# Altium schematic sheet SENSORS.SchDoc
size A3; SheetNumber: 5; SheetTotal: 9
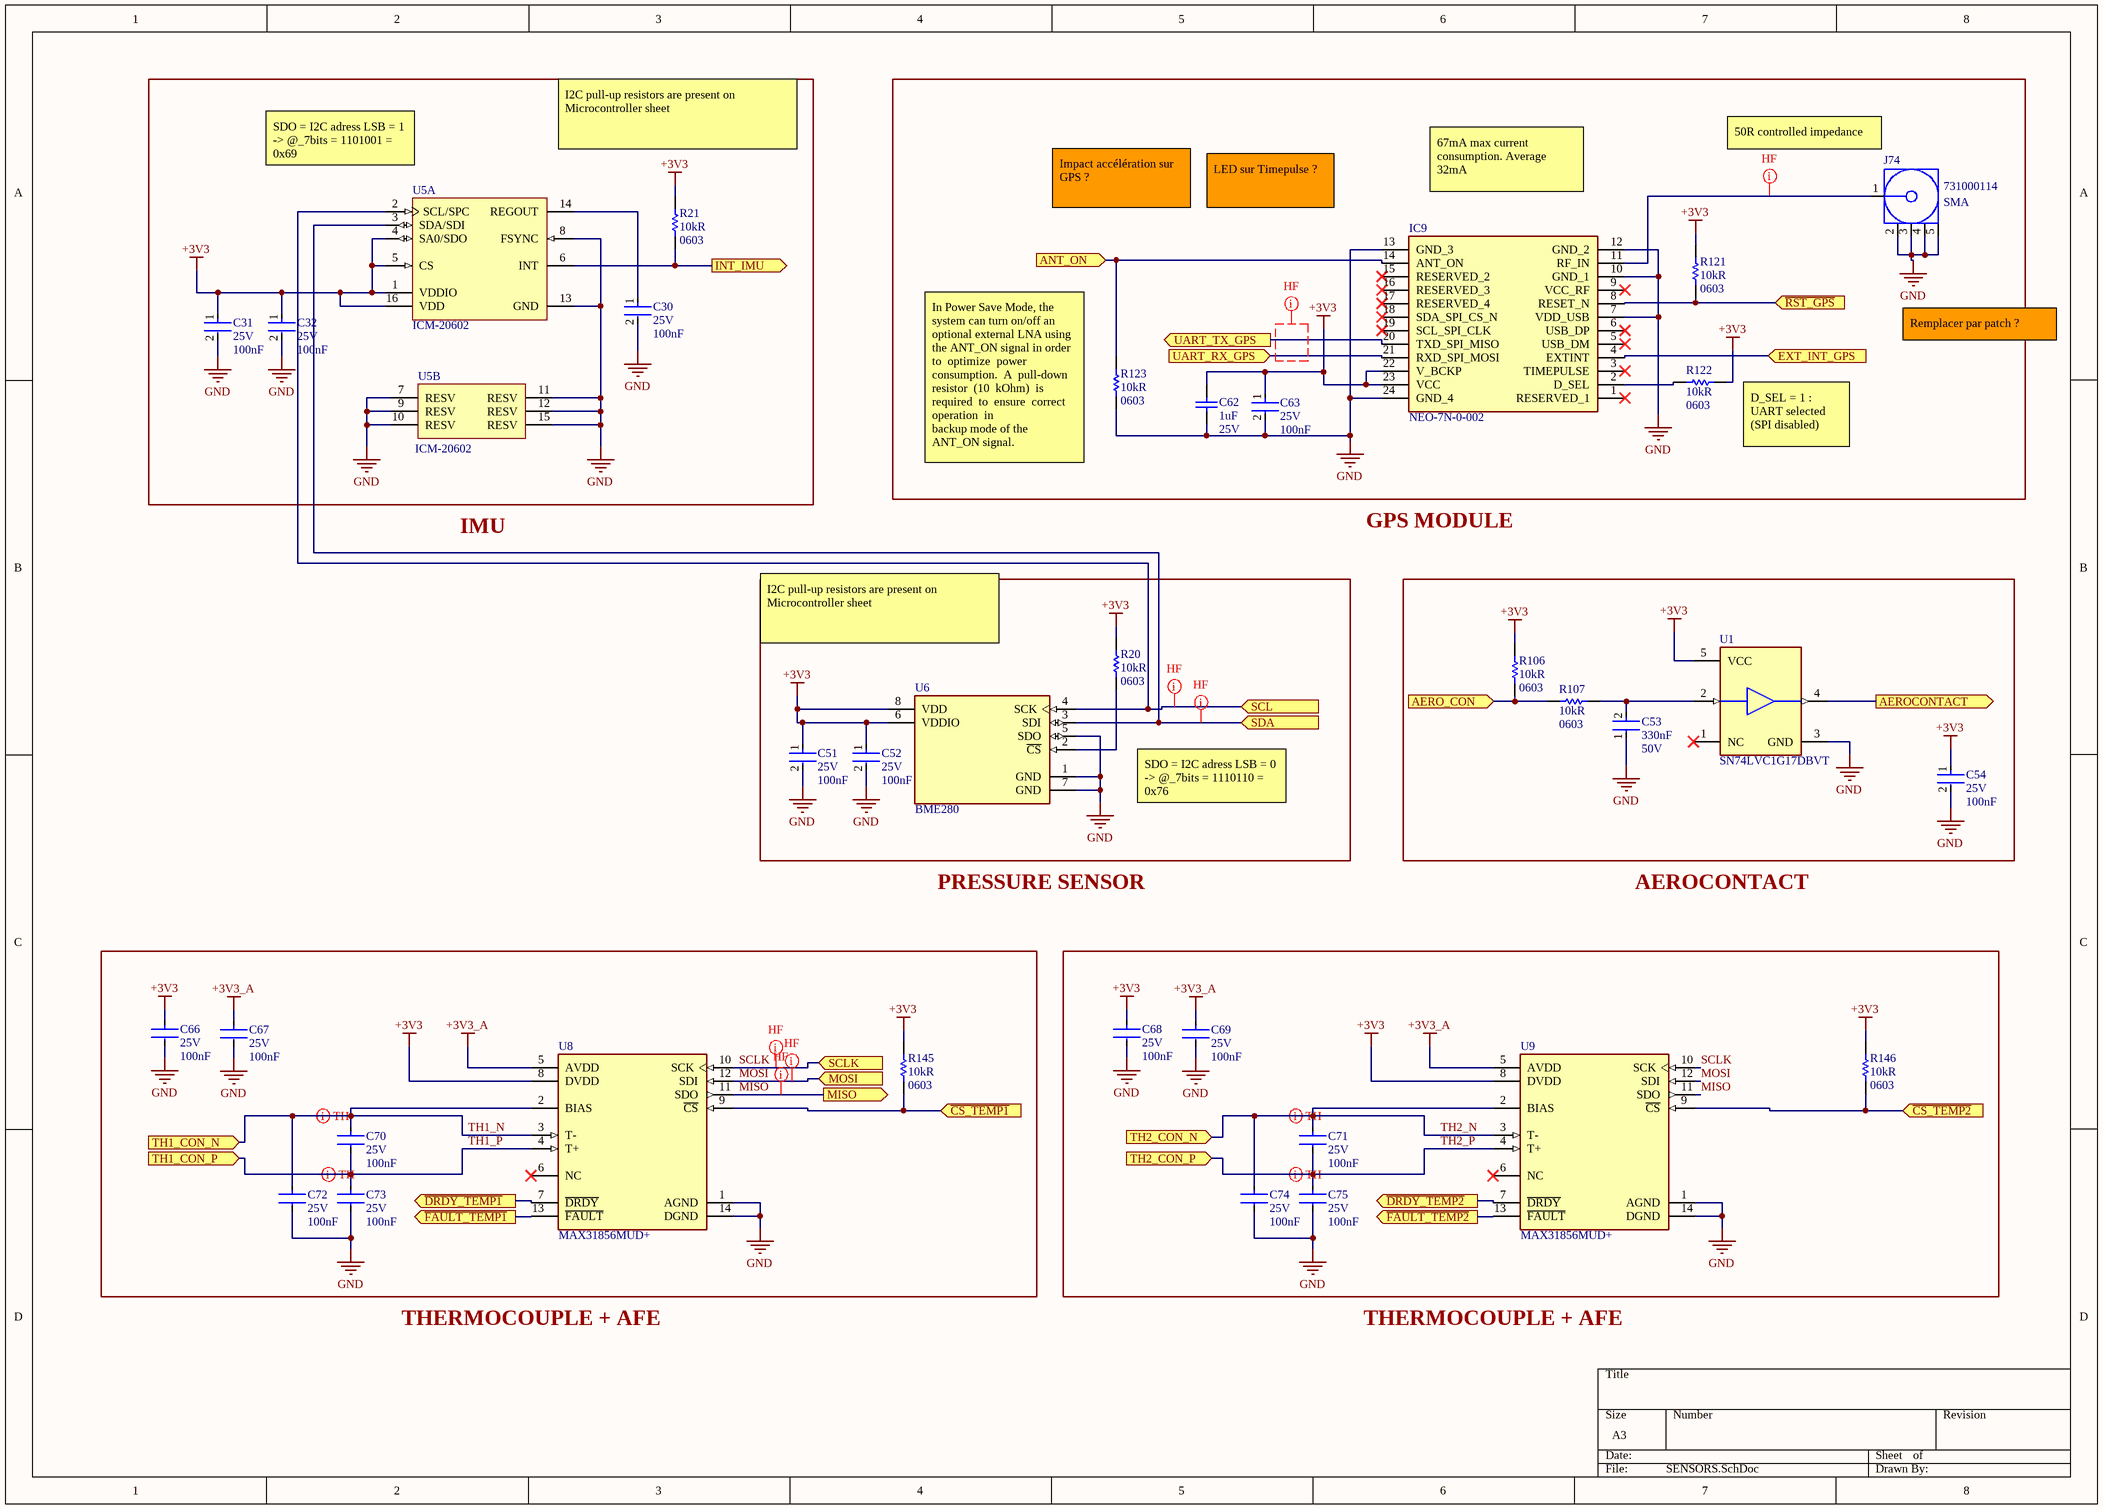
[diagram p0: SENSORS.SchDoc]

## Parts
C30  Voltage Rating (DC): 25V  Capacitance: 100nF  [FP-CGA3E-0_3-0_1-MFG]  (hidden comment: CGA3E2X7R1E104K080AA)
C31  Voltage Rating (DC): 25V  Capacitance: 100nF  [FP-CGA3E-0_3-0_1-MFG]  (hidden comment: CGA3E2X7R1E104K080AA)
C32  Voltage Rating (DC): 25V  Capacitance: 100nF  [FP-CGA3E-0_3-0_1-MFG]  (hidden comment: CGA3E2X7R1E104K080AA)
C51  Voltage Rating (DC): 25V  Capacitance: 100nF  [FP-CGA3E-0_3-0_1-MFG]  (hidden comment: CGA3E2X7R1E104K080AA)
C52  Voltage Rating (DC): 25V  Capacitance: 100nF  [FP-CGA3E-0_3-0_1-MFG]  (hidden comment: CGA3E2X7R1E104K080AA)
C53  Capacitance: 330nF  Voltage Rating: 50V  [FP-C1608-080-0_1-IPC_B]  (hidden comment: C1608X7R1H334K080AC)
C54  Voltage Rating (DC): 25V  Capacitance: 100nF  [FP-CGA3E-0_3-0_1-MFG]  (hidden comment: CGA3E2X7R1E104K080AA)
C62  Capacitance: 1uF  Voltage Rating (DC): 25V  [CAPC1608X90X35LL15T15]  (hidden comment: C0603C105K3PAC7867)
C63  Voltage Rating (DC): 25V  Capacitance: 100nF  [FP-CGA3E-0_3-0_1-MFG]  (hidden comment: CGA3E2X7R1E104K080AA)
C66  Voltage Rating (DC): 25V  Capacitance: 100nF  [FP-CGA3E-0_3-0_1-MFG]  (hidden comment: CGA3E2X7R1E104K080AA)
C67  Voltage Rating (DC): 25V  Capacitance: 100nF  [FP-CGA3E-0_3-0_1-MFG]  (hidden comment: CGA3E2X7R1E104K080AA)
C68  Voltage Rating (DC): 25V  Capacitance: 100nF  [FP-CGA3E-0_3-0_1-MFG]  (hidden comment: CGA3E2X7R1E104K080AA)
C69  Voltage Rating (DC): 25V  Capacitance: 100nF  [FP-CGA3E-0_3-0_1-MFG]  (hidden comment: CGA3E2X7R1E104K080AA)
C70  Voltage Rating (DC): 25V  Capacitance: 100nF  [FP-CGA3E-0_3-0_1-MFG]  (hidden comment: CGA3E2X7R1E104K080AA)
C71  Voltage Rating (DC): 25V  Capacitance: 100nF  [FP-CGA3E-0_3-0_1-MFG]  (hidden comment: CGA3E2X7R1E104K080AA)
C72  Voltage Rating (DC): 25V  Capacitance: 100nF  [FP-CGA3E-0_3-0_1-MFG]  (hidden comment: CGA3E2X7R1E104K080AA)
C73  Voltage Rating (DC): 25V  Capacitance: 100nF  [FP-CGA3E-0_3-0_1-MFG]  (hidden comment: CGA3E2X7R1E104K080AA)
C74  Voltage Rating (DC): 25V  Capacitance: 100nF  [FP-CGA3E-0_3-0_1-MFG]  (hidden comment: CGA3E2X7R1E104K080AA)
C75  Voltage Rating (DC): 25V  Capacitance: 100nF  [FP-CGA3E-0_3-0_1-MFG]  (hidden comment: CGA3E2X7R1E104K080AA)
IC9  NEO-7N-0-002  [NEO7N0002]
J74  731000114  Case/Package: SMA  [MOLX-731000114_V]
R20  Resistance: 10kR  Case Code (Imperial): 0603  [RESC1609X55X30LL15T15]  (hidden comment: ERJ3EKF1002V)
R21  Resistance: 10kR  Case Code (Imperial): 0603  [RESC1609X55X30LL15T15]  (hidden comment: ERJ3EKF1002V)
R106  Resistance: 10kR  Case Code (Imperial): 0603  [RESC1609X55X30LL15T15]  (hidden comment: ERJ3EKF1002V)
R107  Resistance: 10kR  Case Code (Imperial): 0603  [RESC1609X55X30LL15T15]  (hidden comment: ERJ3EKF1002V)
R121  Resistance: 10kR  Case Code (Imperial): 0603  [RESC1609X55X30LL15T15]  (hidden comment: ERJ3EKF1002V)
R122  Resistance: 10kR  Case Code (Imperial): 0603  [RESC1609X55X30LL15T15]  (hidden comment: ERJ3EKF1002V)
R123  Resistance: 10kR  Case Code (Imperial): 0603  [RESC1609X55X30LL15T15]  (hidden comment: ERJ3EKF1002V)
R145  Resistance: 10kR  Case Code (Imperial): 0603  [RESC1609X55X30LL15T15]  (hidden comment: ERJ3EKF1002V)
R146  Resistance: 10kR  Case Code (Imperial): 0603  [RESC1609X55X30LL15T15]  (hidden comment: ERJ3EKF1002V)
U1  SN74LVC1G17DBVT  [FP-DBV0005A-MFG]
U5  ICM-20602  [INSE-I62-16]  (parts A,B of 2)
U6  BME280  [FP-BME280-MFG]
U8  MAX31856MUD+  [FP-U14-2-MFG]
U9  MAX31856MUD+  [FP-U14-2-MFG]

## Ports
AERO_CON (in), AEROCONTACT (out), ANT_ON (in), EXT_INT_GPS (in), INT_IMU (out), MISO (out), MOSI (in), SCL (in), SCLK (in), SDA (in), TH1_CON_N (in), TH1_CON_P (in), TH2_CON_N (in), TH2_CON_P (in), UART_RX_GPS (in), UART_TX_GPS (out), ~{CS_TEMP1} (in), ~{CS_TEMP2} (in), ~{DRDY_TEMP1} (out), ~{DRDY_TEMP2} (out), ~{FAULT_TEMP1} (out), ~{FAULT_TEMP2} (out), ~{RST_GPS} (in)

## Nets
+3V3: C31.1 C32.1 C51.1 C52.1 C54.1 C62.2 C63.1 C66.1 C68.1 IC9.22(V_BCKP) IC9.23(VCC) R20.2 R21.2 R106.2 R121.2 R122.2 R145.2 R146.2 U1.5(VCC) U5.1(VDDIO) U5.4(SA0/SDO) U5.5(CS) U5.16(VDD) U6.6(VDDIO) U6.8(VDD) U8.8(DVDD) U9.8(DVDD)
+3V3_A: C67.1 C69.1 U8.5(AVDD) U9.5(AVDD)
GND: C30.2 C31.2 C32.2 C51.2 C52.2 C53.1 C54.2 C62.1 C63.2 C66.2 C67.2 C68.2 C69.2 C72.2 C73.2 C74.2 C75.2 IC9.7(VDD_USB) IC9.10(GND_1) IC9.12(GND_2) IC9.13(GND_3) IC9.24(GND_4) J74.2 J74.3 J74.4 J74.5 R123.1 U1.3(GND) U5.7(RESV) U5.8(FSYNC) U5.9(RESV) U5.10(RESV) U5.11(RESV) U5.12(RESV) U5.13(GND) U5.15(RESV) U6.1(GND) U6.5(SDO) U6.7(GND) U8.1(AGND) U8.14(DGND) U9.1(AGND) U9.14(DGND)
~{CS_TEMP1}: R145.1 U8.9(~{CS}) ; port ~{CS_TEMP1}
~{CS_TEMP2}: R146.1 U9.9(~{CS}) ; port ~{CS_TEMP2}
~{DRDY_TEMP1}: U8.7(~{DRDY}) ; port ~{DRDY_TEMP1}
~{DRDY_TEMP2}: U9.7(~{DRDY}) ; port ~{DRDY_TEMP2}
~{FAULT_TEMP1}: U8.13(~{FAULT}) ; port ~{FAULT_TEMP1}
~{FAULT_TEMP2}: U9.13(~{FAULT}) ; port ~{FAULT_TEMP2}
~{RST_GPS}: IC9.8(RESET_N) R121.1 ; port ~{RST_GPS}
AERO_CON: R106.1 R107.2 ; port AERO_CON
AEROCONTACT: U1.4(Y) ; port AEROCONTACT
ANT_ON: IC9.14(ANT_ON) R123.2 ; port ANT_ON
EXT_INT_GPS: IC9.4(EXTINT) ; port EXT_INT_GPS
INT_IMU: R21.1 U5.6(INT) ; port INT_IMU
MISO: U8.11(SDO) U9.11(SDO) ; port MISO
MOSI: U8.12(SDI) U9.12(SDI) ; port MOSI
SCL: U5.2(SCL/SPC) U6.4(SCK) ; port SCL
SCLK: U8.10(SCK) U9.10(SCK) ; port SCLK
SDA: U5.3(SDA/SDI) U6.3(SDI) ; port SDA
TH1_N: C70.1 C72.1 U8.2(BIAS) U8.3(T-) ; port TH1_CON_N
TH1_P: C70.2 C73.1 U8.4(T+) ; port TH1_CON_P
TH2_N: C71.1 C74.1 U9.2(BIAS) U9.3(T-) ; port TH2_CON_N
TH2_P: C71.2 C75.1 U9.4(T+) ; port TH2_CON_P
UART_RX_GPS: IC9.21(RXD_SPI_MOSI) ; port UART_RX_GPS
UART_TX_GPS: IC9.20(TXD_SPI_MISO) ; port UART_TX_GPS
NetC30_1: C30.1 U5.14(REGOUT)
NetC53_2: C53.2 R107.1 U1.2(A)
NetIC9_2: IC9.2(D_SEL) R122.1
NetIC9_11: IC9.11(RF_IN) J74.1
NetR20_1: R20.1 U6.2(~{CS})

Not connected (* = marked no-connect by the designer): IC9 1(RESERVED_1)* 3(TIMEPULSE)* 5(USB_DM)* 6(USB_DP)* 9(VCC_RF)* 15(RESERVED_2)* 16(RESERVED_3)* 17(RESERVED_4)* 18(SDA_SPI_CS_N)* 19(SCL_SPI_CLK)*; U1 1(NC)*; U8 6(NC)*; U9 6(NC)*

## Layout directives
net class HF: (no net found under the mark), MISO, MOSI, NetIC9_11, SCL, SCLK, SDA
differential pair; differential pair class TH: TH1_N, TH1_P, TH2_N, TH2_P

## Notes on the sheet
- (near U5) SDO = I2C adress LSB = 1 -> @_7bits = 1101001 = 0x69
- I2C pull-up resistors are present on Microcontroller sheet
- (near J74) 50R controlled impedance
- Impact accélération sur GPS ?
- LED sur Timepulse ?
- 67mA max current consumption. Average 32mA
- Remplacer par patch ?
- (near R122) D_SEL = 1 : UART selected (SPI disabled)
- (near R123) In Power Save Mode, the system can turn on/off an optional external LNA using the ANT_ON signal in order
  to  optimize  power  consumption.  A  pull-down  resistor  (10  kOhm)  is  required  to  ensure  correct  operation  in
  backup mode of the ANT_ON signal.
- GPS MODULE
- IMU
- SDO = I2C adress LSB = 0 -> @_7bits = 1110110 = 0x76
- PRESSURE SENSOR
- AEROCONTACT
- THERMOCOUPLE + AFE

## Library data of the parts
C30-C32 C51 C52 C54 C63 C66-C75 = CMP-08246-002186-1: Cap Ceramic 100nF 25V X7R 10% Pad SMD 0603 +125°C Automotive T/R; Manufacturer: TDK; Composition: Ceramic; Dielectric: X7R; Ratings: AEC-Q200; Length: 1.6mm; REACH SVHC: No SVHC; Width: 0.031inch; Packaging: Tape and Reel; Case/Package: 0603; Height: 0.8mm; Termination: SMD/SMT; Max Operating Temperature: 125°C; Thickness: 0.035inch; Case Code (Metric): 1608; Lead Free: Lead Free; Mount: Surface Mount; Voltage Rating: 25V; Tolerance: 10%; Weight: 7.1E-05oz; Min Operating Temperature: -55°C; Package Quantity: 1; Depth: 0.8mm; Case Code (Imperial): 0603; Supplier 1: Mouser; Supplier Part Number 1: 810-CGA3E2X7R1E104K; Manufacturer Part Number: CGA3E2X7R1E104K080AA; RoHS: Yes; Category: Ceramic Capacitors; Stock 1: 488891; Pricing 1: 1=0,12000, 10=0,05600, 50=0,05600, 100=0,02500, 1000=0,01400, 10000=0,01000 (USD); Series: CGA; Resistor Type: Ceramic; RoHS Compliant: Yes; ComponentLink1URL: https://datasheet.ciiva.com/24220/cga3e2x7r1e104k080aa-265934-24220022.pdf?src-supplier=Mouser; ComponentLink1Description: https://datasheet.ciiva.com/24220/cga3e2x7r1e104k080aa-265934-24220022.pdf?src-supplier=Mouser; ComponentLink2URL: https://datasheet.ciiva.com/22725/1735392-22725638.pdf?src-supplier=Element14; ComponentLink2Description: https://datasheet.ciiva.com/22725/1735392-22725638.pdf?src-supplier=Element14; ComponentLink3URL: https://datasheet.ciiva.com/22725/1735392-22725639.pdf?src-supplier=Element14; ComponentLink3Description: https://datasheet.ciiva.com/22725/1735392-22725639.pdf?src-supplier=Element14; ComponentLink4URL: https://datasheet.ciiva.com/16427/mlccspec-automotive-general-midvoltage-en-16427320.pdf?src-supplier=Future+Electronics; ComponentLink4Description: https://datasheet.ciiva.com/16427/mlccspec-automotive-general-midvoltage-en-16427320.pdf?src-supplier=Future+Electronics; ComponentLink5URL: https://datasheet.ciiva.com/23803/1735392-23803082.pdf?src-supplier=Newark; ComponentLink5Description: https://datasheet.ciiva.com/23803/1735392-23803082.pdf?src-supplier=Newark
C53 = CMP-2000-07551-2: Multilayer Ceramic Capacitors 330nF ±10% 50V X7R SMD 0603; Manufacturer: TDK; Case Code (Imperial): 0603; Case Code (Metric): 1608; Dielectric: X7R; Length: 1.6mm; Construction: Flat; Resistor Type: Ceramic; Mount: Surface Mount; Packaging: Tape and Reel; Series: C; Case/Package: 0603; Lead Free: Lead Free; Tolerance: 10%; Voltage: 50V; REACH SVHC: No SVHC; Height: 0.8mm; Weight: 7.1E-05oz; Termination: SMD/SMT; Max Operating Temperature: 125°C; RoHS Compliant: Yes; Min Operating Temperature: -55°C; Depth: 0.8mm; Package Quantity: 1; Thickness: 0.037inch; Voltage Rating (DC): 50V; Dielectric Material: Ceramic; Width: 0.031inch; Supplier 1: Mouser; Supplier Part Number 1: 810-C1608X7R1H334K; Manufacturer Part Number: C1608X7R1H334K080AC; RoHS: Yes; Category: Ceramic Capacitors; Stock 1: 79489; Pricing 1: 1=0,25000, 10=0,11500, 50=0,11500, 100=0,09700, 1000=0,06000, 10000=0,05000 (USD); ComponentLink1URL: https://datasheet.ciiva.com/22718/1796654-22718021.pdf?src-supplier=Element14; ComponentLink1Description: https://datasheet.ciiva.com/22718/1796654-22718021.pdf?src-supplier=Element14; ComponentLink2URL: https://datasheet.ciiva.com/6290/tdkmlcccaprange-6290791.pdf?src-supplier=Digi-Key; ComponentLink2Description: https://datasheet.ciiva.com/6290/tdkmlcccaprange-6290791.pdf?src-supplier=Digi-Key; ComponentLink3URL: https://datasheet.ciiva.com/16427/general-b11-16427753.pdf?src-supplier=Future+Electronics; ComponentLink3Description: https://datasheet.ciiva.com/16427/general-b11-16427753.pdf?src-supplier=Future+Electronics; ComponentLink4URL: https://datasheet.ciiva.com/23803/1735394-23803004.pdf?src-supplier=Newark; ComponentLink4Description: https://datasheet.ciiva.com/23803/1735394-23803004.pdf?src-supplier=Newark; ComponentLink5URL: https://datasheet.ciiva.com/28451/1796654-28451356.pdf?src-supplier=Element14; ComponentLink5Description: https://datasheet.ciiva.com/28451/1796654-28451356.pdf?src-supplier=Element14; ComponentLink6URL: https://datasheet.ciiva.com/6290/tdkmlcccaprange-6290782.pdf?src-supplier=Digi-Key; ComponentLink6Description: https://datasheet.ciiva.com/6290/tdkmlcccaprange-6290782.pdf?src-supplier=Digi-Key
C62 = CMP-2006-02216-2: Manufacturer: Kemet; Manufacturer Part Number: C0603C105K3PACTU; Dielectric Material: Ceramic; Tolerance: 10%; Dielectric: X5R; Part Number: C0603C105K3PAC7867; Supplier 1: Mouser; Supplier Part Number 1: 80-C0603C105K3P; RoHS: Yes; Category: Ceramic Capacitors; Stock 1: 10085; Pricing 1: 1=0,30000, 10=0,15600, 50=0,15600, 100=0,09300, 500=0,08200, 1000=0,07300, 4000=0,05700, 10000=0,05700 (USD); Mount: Surface Mount,PCB; Case/Package: 0603; Number of Pins: 2; Case Code (Imperial): 0603; Case Code (Metric): 1608; Contact Plating: Tin,Matte; Min Operating Temperature: -55°C; Max Operating Temperature: 85°C; Packaging: Tape and Reel; Termination: SMD/SMT; Voltage Rating: 25V; Package Quantity: 4000; Voltage: 25V; Series: C0603C; Construction: Flat; Length: 1.6mm; Width: 0.031inch; Height: 0.8mm; Depth: 0.8mm; Thickness: 0.034inch; Radiation Hardening: No; REACH SVHC: No SVHC; RoHS Compliant: Yes; Lead Free: Lead Free; ComponentLink1URL: https://datasheet.ciiva.com/5998/40889-5998745.pdf?src-supplier=Farnell; ComponentLink1Description: https://datasheet.ciiva.com/5998/40889-5998745.pdf?src-supplier=Farnell; ComponentLink2URL: https://datasheet.ciiva.com/28610/1918694-28610792.pdf?src-supplier=Element14; ComponentLink2Description: https://datasheet.ciiva.com/28610/1918694-28610792.pdf?src-supplier=Element14
IC9 = NEO-7N-0-002: Integrated Circuit; Manufacturer_Name: U-Blox; Datasheet Link: https://www.u-blox.com/sites/default/files/products/documents/NEO-7_DataSheet_%28UBX-13003830%29.pdf; Height: 2.6mm; Manufacturer_Part_Number: NEO-7N-0-002
J74 = CMP-2000-05487-1: SMA Right-Angle PCB Jack Receptacle, Brass Body, Gold Plated, 50 Ohm, 5-Pin THD, RoHS, Tray; Manufacturer: Molex; Manufacturer Part Number: 73100-0114; Dielectric Material: PTFE; Polarity: Normal; Impedance: 50R; Connector Type: SMA,PCB,Coaxial; Gender: Female; Frequency: 12Hz; Max Frequency: 18GHz; Voltage Rating: 500V; Operating Frequency: 0 to 12 GHz; Datasheet Version: 09/2016; Package Description: 5-Pin Through Hole Device, Body 14.8 x 6.35 mm, Pitch 2.54 mm; Datasheet URL: http://www.molex.com/webdocs/datasheets/pdf/en-us/0731000114_RF_COAX_CONNECTORS.pdf; Manufacturer URL: http://www.molex.com/; Package Reference: 731000114; Mounting Technology: ThroughHole; Package URL: http://www.molex.com/pdm_docs/sd/731000114_sd.pdf; Supplier 1: Mouser; Supplier Part Number 1: 538-73100-0114; RoHS: Yes; Category: RF / Coaxial Connectors; Stock 1: 639; Pricing 1: 1=5,69000, 10=5,01000, 50=5,01000, 100=3,99000, 500=3,88000, 1000=3,31000, 2500=3,07000, 5000=2,95000, 10000=2,84000 (USD); Mount: Through Hole; Contact Plating: Gold; Contact Material: Copper; Body Material: Brass; Body Plating: Gold; Insulation Material: Teflon; Housing Color: Gold; Plating: Gold; Center Contact Plating: Gold; Min Operating Temperature: -65°C; Max Operating Temperature: 165°C; Package Quantity: 1760; Packaging: Tray; Series: 73100; Termination: Solder; Orientation: Right Angle; Fastening Type: Threaded; Length: 14.8mm; Radiation Hardening: No; REACH SVHC: Unknown; ComponentLink1URL: https://datasheet.ciiva.com/7996/1596725-7996452.pdf?src-supplier=Element14; ComponentLink1Description: https://datasheet.ciiva.com/7996/1596725-7996452.pdf?src-supplier=Element14; ComponentLink2URL: https://datasheet.ciiva.com/30104/82220731000114-rf-coax-nectors-30104097.pdf?src-supplier=Onlinecomponents.com; ComponentLink2Description: https://datasheet.ciiva.com/30104/82220731000114-rf-coax-nectors-30104097.pdf?src-supplier=Onlinecomponents.com; ComponentLink3URL: https://datasheet.ciiva.com/26945/getdatasheetpartid-152702-26945396.pdf?src-supplier=Verical; ComponentLink3Description: https://datasheet.ciiva.com/26945/getdatasheetpartid-152702-26945396.pdf?src-supplier=Verical
R20 R21 R106 R107 R121-R123 R145 R146 = CMP-1012-00623-3: Chip Resistor, 10 KOhm, +/- 1%, 0.1 W, -55 to 155 degC, 0603 (1608 Metric), RoHS, Tape and Reel; Manufacturer: Panasonic; Manufacturer Part Number: ERJ-3EKF1002V; Voltage Rating: 75V; Power Rating: 100mW; Temperature Coefficient: 100ppm\/degreesC; Case\/Package: 0603; Number of Pins: 2; Package Reference: 603; Depth: 0.8mm; Mount: SurfaceMount; Package Description: 2-Pin Surface Mount Device, Body 1.6 x 0.85 mm; Datasheet Version: 02/2017; Length: 1.6mm; Lead Free: LeadFree; Height: 0.45mm; Number of Terminations: 2; Max Power Dissipation: 100mW; Min Operating Temperature: -55degC; Datasheet URL: https://industrial.panasonic.com/cdbs/www-data/pdf/RDA0000/AOA0000C304.pdf; Termination: SMD/SMT; Case Code (Metric): 1608; Tolerance: 1%; Max Operating Temperature: 155degC; RoHSCompliant: true; Voltage Rating (DC): 75V; Radiation Hardening: No; Packaging: TapeandReel; Composition: ThickFilm; Mounting Technology: SurfaceMount; Manufacturer URL: http://www.panasonic.com/; Width: 0.031inch; REACH SVHC: NoSVHC; Contact Plating: Tin; Military Standard: Not; Package Quantity: 1; Supplier 1: Mouser; Supplier Part Number 1: 667-ERJ-3EKF1002V; RoHS: Yes; Category: Chip SMD Resistors; Stock 1: 20455; Pricing 1: 1=0,10000, 10=0,04000, 50=0,04000, 100=0,01700, 1000=0,00700, 5000=0,00500, 10000=0,00500 (USD); Case/Package: 0603; Size Code: 0603; Resistor Type: Thick Film; Series: ERJ; Resistance Tolerance: 1%; Construction: Rectangular; Features: Automotive AEC-Q200; Technology: THICK FILM; RoHS Compliant: Yes; ComponentLink1URL: https://datasheet.ciiva.com/16511/aoa0000ce2-16511861.pdf?src-supplier=Avnet+Asia; ComponentLink1Description: https://datasheet.ciiva.com/16511/aoa0000ce2-16511861.pdf?src-supplier=Avnet+Asia; ComponentLink2URL: https://datasheet.ciiva.com/46372/1678782-46372725.pdf?src-supplier=Element14; ComponentLink2Description: https://datasheet.ciiva.com/46372/1678782-46372725.pdf?src-supplier=Element14; ComponentLink3URL: https://datasheet.ciiva.com/28514/426256-28514198.pdf?src-supplier=Element14; ComponentLink3Description: https://datasheet.ciiva.com/28514/426256-28514198.pdf?src-supplier=Element14; ComponentLink4URL: https://datasheet.ciiva.com/9194/aoa0000ce2-9194199.pdf?src-supplier=Avnet; ComponentLink4Description: https://datasheet.ciiva.com/9194/aoa0000ce2-9194199.pdf?src-supplier=Avnet; ComponentLink5URL: https://datasheet.ciiva.com/7830/aoa0000ce2-7830729.pdf?src-supplier=Element14; ComponentLink5Description: https://datasheet.ciiva.com/7830/aoa0000ce2-7830729.pdf?src-supplier=Element14; ComponentLink6URL: https://datasheet.ciiva.com/17212/aoa0000ce2-17212105.pdf?src-supplier=Avnet+Europe; ComponentLink6Description: https://datasheet.ciiva.com/17212/aoa0000ce2-17212105.pdf?src-supplier=Avnet+Europe; ComponentLink7URL: https://datasheet.ciiva.com/30208/aoa0000ce2-30208985.pdf?src-supplier=Onlinecomponents.com; ComponentLink7Description: https://datasheet.ciiva.com/30208/aoa0000ce2-30208985.pdf?src-supplier=Onlinecomponents.com; ComponentLink8URL: https://datasheet.ciiva.com/48530/aoa0000ce2-48530988.pdf?src-supplier=Avnet; ComponentLink8Description: https://datasheet.ciiva.com/48530/aoa0000ce2-48530988.pdf?src-supplier=Avnet; ComponentLink9URL: https://datasheet.ciiva.com/24070/aoa0000ce2-24070318.pdf?src-supplier=Mouser; ComponentLink9Description: https://datasheet.ciiva.com/24070/aoa0000ce2-24070318.pdf?src-supplier=Mouser; ComponentLink10URL: https://datasheet.ciiva.com/16759/70260748-16759807.pdf?src-supplier=Allied+Electronics; ComponentLink10Description: https://datasheet.ciiva.com/16759/70260748-16759807.pdf?src-supplier=Allied+Electronics
U1 = CMP-0859-00041-5: IC BUF NON-INVERT 5.5V SOT23-5; Manufacturer: Texas Instruments; Number Of Circuits: 1; Logic Function Desc: Non-Inverting; Standoff Height: 0mm; Propagation Delay: 4.6ns; Min Supply Voltage: 1.65V; Nominal Supply Current: 10uA; Category: IC; Height: 1.45mm; Manufacturer Part Number: SN74LVC1G17DBVT; Temperature Range High: +125°C; Device Class L2: Logic ICs; Temperature: -40°C to +125°C; Temperature Range Low: -40°C; Device Class L3: Buffers; Package: DBV0005A; Max Supply Voltage: 5.5V; Ambient Temperature Range High: +125°C; Number Of Outputs: 1; Device Class L1: Integrated Circuits (ICs); ComponentLink2URL: http://www.ti.com/lit/ds/symlink/sn74lvc1g17.pdf; Octopart: https://octopart.com/sn74lvc1g17dbvt-texas+instruments-2326350; Number Of Inputs: 1; Ambient Temperature Range Low: -40°C; ComponentLink2Description: Datasheet; Digikey Description: IC BUF NON-INVERT 5.5V SOT23-5; Lead Free: Yes; Automotive: No; RoHS: TRUE; Mouser Description: Buffers & Line Drivers SNGL Schmitt Trigger Buffer
U5 = CMP-2000-07589-1: High Performance 6-Axis MEMS MotionTracking(TM) Device, 1.71 to 3.45 V, -40 to 85 degC, 16-Pin LGA, RoHS; Manufacturer: InvenSense; Sensor Type: Temperature; Output Type: I2C; RoHSCompliant: True; Datasheet Version: Rev. 1.0, 10/2016; Datasheet URL: http://www.invensense.com/wp-content/uploads/2016/10/DS-000176-ICM-20602-v1.0.pdf; Min Operating Temperature: -40degC; Mounting Technology: SurfaceMount; Max Operating Temperature: 85degC; Manufacturer URL: http://www.invensense.com/; Package Reference: I62-16; Package Description: 16-Pin Land Grid Array, Body 3 x 3 mm, Pitch 0.5 mm
U6 = CMP-2000-05073-3: SENSOR PRESSURE HUMIDITY TEMP; Sensor Type: Temperature; Accuracy: 3%; Response Time: 1s; Output Type: SPI; Min Operating Temperature: -40°C; Max Operating Temperature: 85°C; Case/Package: LGA; Packaging: Cut Tape; Mount: Surface Mount; Lead Free: Lead Free; Number of Pins: 8
U8 U9 = CMP-05752-000010-1: IC CONV THERMOCOUPLE 14TSSOP; Operating Supply Current: 1.2mA; Min Supply Voltage: 3V; Max Supply Voltage: 3.6V; Output Type: Digital; Interface: SPI; Min Operating Temperature: -55°C; Max Operating Temperature: 125°C; Case/Package: TSSOP; Mount: Surface Mount; Packaging: Rail/Tube; Number of Pins: 14